# EAGLE design ctecka_stolni (EAGLE 6.5.0)
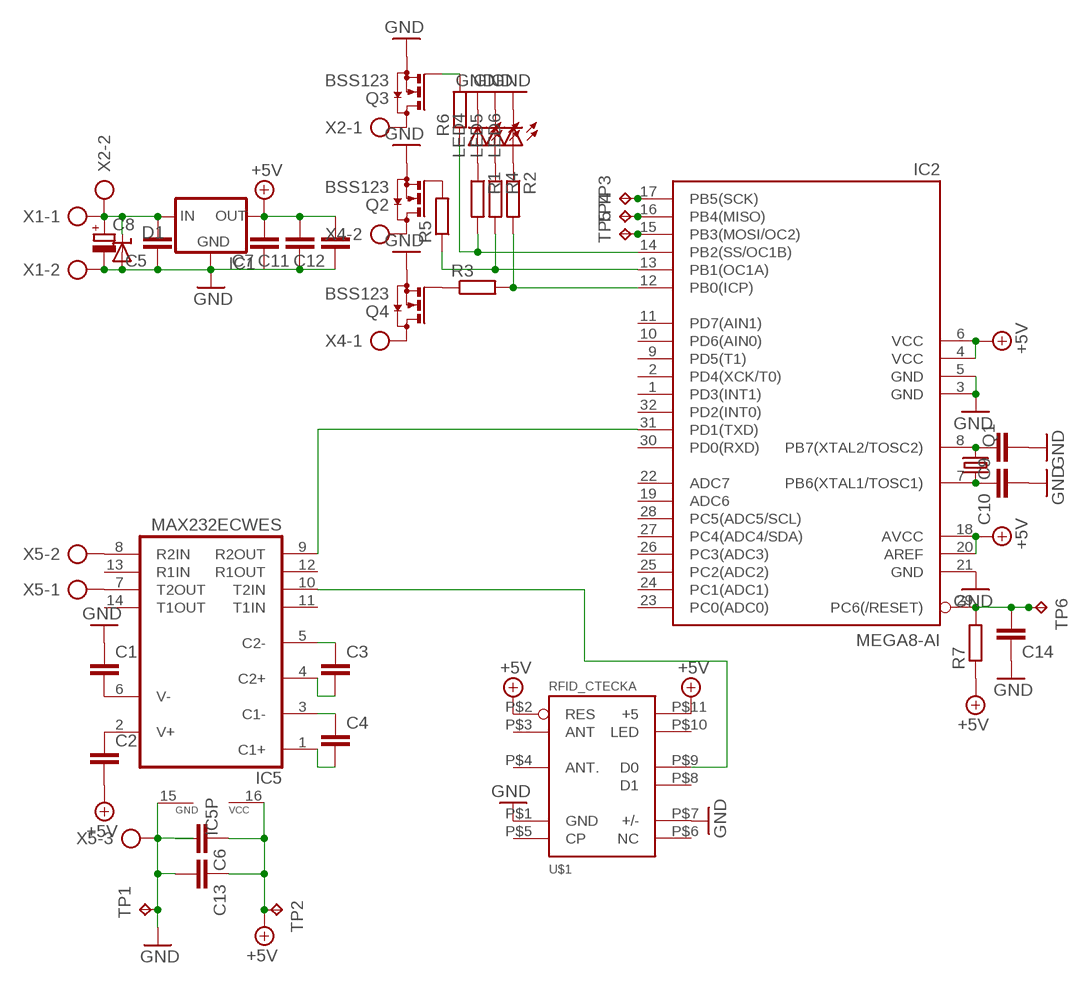
[diagram p0: schematic, sheet 1]

## Parts
C1  C-EUC0603  [C0603]
C2  C-EUC0603  [C0603]
C3  C-EUC0603  [C0603]
C4  C-EUC0603  [C0603]
C5  C-EUC0603  [C0603]
C6  C-EUC0603  [C0603]
C7  C-EUC0603  [C0603]
C8  CPOL-EUSMCD  [SMC_D]
C9  C-EUC0603  [C0603]
C10  C-EUC0603  [C0603]
C11  C-EUC0603  [C0603]
C12  C-EUC0603  [C0603]
C13  C-EUC0603  [C0603]
C14  C-EUC0603  [C0603]
D1  SUPPRESSOR-SMBG  [SMBG]
IC1  78LXXF  [SOT89R]
IC2  MEGA8-AI  [TQFP32-08]
IC5  MAX232ECWES  [SO16]
LED4  LEDCHIP-LED0805  [CHIP-LED0805]
LED5  LEDCHIP-LED0805  [CHIP-LED0805]
LED6  LEDCHIP-LED0805  [CHIP-LED0805]
Q1  CRYSTALCTS406  [CTS406]
Q2  BSS123  [SOT23]
Q3  BSS123  [SOT23]
Q4  BSS123  [SOT23]
R1  R-EU_R0603  [R0603]
R2  R-EU_R0603  [R0603]
R3  R-EU_R0603  [R0603]
R4  R-EU_R0603  [R0603]
R5  R-EU_R0603  [R0603]
R6  R-EU_R0603  [R0603]
R7  R-EU_R0603  [R0603]
TP1  TPB1,27  [B1,27]
TP2  TPB1,27  [B1,27]
TP3  TPB1,27  [B1,27]
TP4  TPB1,27  [B1,27]
TP5  TPB1,27  [B1,27]
TP6  TPB1,27  [B1,27]
U$1  RFID_CTECKA  [H]
X1  AK500/2  [AK500/2]
X2  AK500/2  [AK500/2]
X4  AK500/2  [AK500/2]
X5  AK500/3  [AK500/3]

## Nets
+5V: C2.2 C6.1 C7.2 C11.2 C12.2 C13.1 IC1.2(OUT) IC2.4(VCC) IC2.6(VCC) IC2.18(AVCC) IC2.20(AREF) IC5.16(VCC) R7.1 TP2.TP U$1.P$2(RES) U$1.P$11(+5)
GND: C1.1 C5.1 C6.2 C7.1 C8.- C9.2 C10.2 C11.1 C12.1 C13.2 C14.1 D1.A IC1.3(GND) IC2.3(GND) IC2.5(GND) IC2.21(GND) IC5.15(GND) LED4.C LED5.C LED6.C Q2.2(S) Q3.2(S) Q4.2(S) TP1.TP U$1.P$1(GND) U$1.P$7(+/-) X1.2 X5.3
N$1: IC2.17(PB5(SCK)) TP3.TP
N$2: IC2.15(PB3(MOSI/OC2)) TP5.TP
N$3: Q3.3(D) X2.1
N$4: IC2.31(PD1(TXD)) IC5.9(R2OUT)
N$5: C3.1 IC5.5(C2-)
N$6: C4.1 IC5.3(C1-)
N$7: C1.2 IC5.6(V-)
N$8: C2.1 IC5.2(V+)
N$9: IC5.7(T2OUT) X5.1
N$10: IC5.8(R2IN) X5.2
N$11: C4.2 IC5.1(C1+)
N$12: C3.2 IC5.4(C2+)
N$13: IC2.16(PB4(MISO)) TP4.TP
N$14: C14.2 IC2.29(PC6(/RESET)) R7.2 TP6.TP
N$15: C9.1 IC2.8(PB7(XTAL2/TOSC2)) Q1.3
N$16: C10.1 IC2.7(PB6(XTAL1/TOSC1)) Q1.1
N$17: Q2.1(G) R5.2
N$18: Q2.3(D) X4.2
N$19: Q4.1(G) R3.1
N$20: Q4.3(D) X4.1
N$21: LED4.A R1.1
N$22: LED5.A R4.1
N$23: LED6.A R2.1
N$24: Q3.1(G) R6.2
N$26: IC5.10(T2IN) U$1.P$9(D0)
N$29: IC2.12(PB0(ICP)) R2.2 R3.2
N$30: IC2.13(PB1(OC1A)) R4.2 R5.1
N$31: IC2.14(PB2(SS/OC1B)) R1.2 R6.1
N$34: C5.2 C8.+ D1.C IC1.1(IN) X1.1 X2.2
Unconnected: IC2.1(PD3(INT1)) IC2.2(PD4(XCK/T0)) IC2.9(PD5(T1)) IC2.10(PD6(AIN0)) IC2.11(PD7(AIN1)) IC2.19(ADC6) IC2.22(ADC7) IC2.23(PC0(ADC0)) IC2.24(PC1(ADC1)) IC2.25(PC2(ADC2)) IC2.26(PC3(ADC3)) IC2.27(PC4(ADC4/SDA)) IC2.28(PC5(ADC5/SCL)) IC2.30(PD0(RXD)) IC2.32(PD2(INT0)) IC5.11(T1IN) IC5.12(R1OUT) IC5.13(R1IN) IC5.14(T1OUT) U$1.P$3(ANT) U$1.P$4(ANT.) U$1.P$5(CP) U$1.P$6(NC) U$1.P$8(D1) U$1.P$10(LED)

## Library data of the parts
C1-C7 C9-C14 = rcl:C-EU: CAPACITOR, European symbol
C8 = rcl:CPOL-EU: POLARIZED CAPACITOR, European symbol
D1 = diode:SUPPRESSOR-: Suppressor diode
IC1 = v-reg:78LXXF
IC2 = atmel:MEGA8: MICROCONTROLLER 8 Kbytes FLASH, 1 kbytes SRAM, 512 bytes EEPROM, USART, 6-channel 10 bit ADC, 2-channel 8 bit ADC Pin compatible with Atmega48, ATMega88, ATMega168 Source: avr.lbr
IC5 = maxim:MAX232ECWE: RS232 TRANSEIVER
LED4-LED6 = led:LED: LED OSRAM: - CHIPLED LG R971, LG N971, LY N971, LG Q971, LY Q971, LO R971, LY R971 LH N974, LH R974 LS Q976, LO Q976, LY Q976 LO Q996 - Hyper CHIPLED LW Q18S LB Q993, LB Q99A, LB R99A - SideLED LS A670, LO A670, LY A670, LG A670, LP A670 LB A673, LV A673, LT A673, LW A673 LH A674 LY A675 LS A676, LA A676, LO A676, LY A676, LW A676 LS A679, LY A679, LG A679 - Hyper Micro SIDELED® LS Y876, LA Y876, LO Y876, LY Y876 LT Y87S - SmartLED LW L88C, LW L88S LB L89C, LB L89S, LG L890 LS L89K, LO L89K, LY L89K LS L896, LA L896, LO L896, LY L896 - TOPLED LS T670, LO T670, LY T670, LG T670, LP T670 LSG T670, LSP T670, LSY T670, LOP T670, LYG T670 LG T671, LOG T671, LSG T671 LB T673, LV T673, LT T673, LW T673 LH T674 LS T676, LA T676, LO T676, LY T676, LB T676, LH T676, LSB T676, LW T676 LB T67C, LV T67C, LT T67C, LS T67K, LO T67K, LY T67K, LW E67C LS E67B, LA E67B, LO E67B, LY E67B, LB E67C, LV E67C, LT E67C LW T67C LS T679, LY T679, LG T679 LS T770, LO T770, LY T770, LG T770, LP T770 LB T773, LV T773, LT T773, LW T773 LH T774 LS E675, LA E675, LY E675, LS T675 LS T776, LA T776, LO T776, LY T776, LB T776 LHGB T686 LT T68C, LB T68C - Hyper Mini TOPLED® LB M676 - Mini TOPLED Santana® LG M470 LS M47K, LO M47K, LY M47K Source: http://www.osram.convergy.de LUXEON: - LUMILED® LXK2-PW12-R00, LXK2-PW12-S00, LXK2-PW14-U00, LXK2-PW14-V00 LXK2-PM12-R00, LXK2-PM12-S00, LXK2-PM14-U00 LXK2-PE12-Q00, LXK2-PE12-R00, LXK2-PE12-S00, LXK2-PE14-T00, LXK2-PE14-U00 LXK2-PB12-K00, LXK2-PB12-L00, LXK2-PB12-M00, LXK2-PB14-N00, LXK2-PB14-P00, LXK2-PB14-Q00 LXK2-PR12-L00, LXK2-PR12-M00, LXK2-PR14-Q00, LXK2-PR14-R00 LXK2-PD12-Q00, LXK2-PD12-R00, LXK2-PD12-S00 LXK2-PH12-R00, LXK2-PH12-S00 LXK2-PL12-P00, LXK2-PL12-Q00, LXK2-PL12-R00 Source: www.luxeon.com KINGBRIGHT: KA-3528ASYC Source: www.kingbright.com
Q1 = crystal:CRYSTAL: CRYSTAL; OC_FARNELL: unknown; OC_NEWARK: unknown
Q2-Q4 = transistor-small-signal:BSS123: N-CHANNEL MOS FET
R1-R7 = rcl:R-EU_: RESISTOR, European symbol
TP1-TP6 = testpad:TP: Test pad
U$1 = moje:RFID_CTECKA
X1 X2 X4 = con-ptr500:AK500/2: CONNECTOR
X5 = con-ptr500:AK500/3: CONNECTOR

## Board
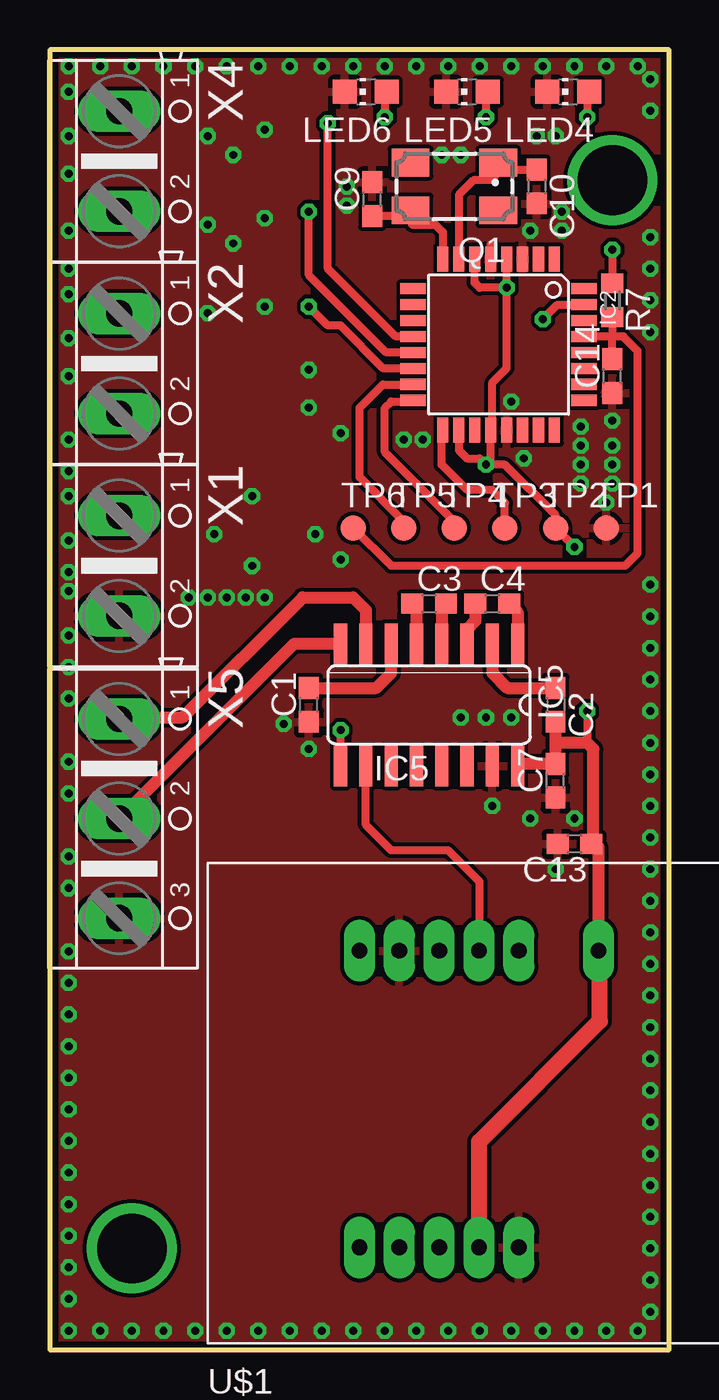
[diagram p1: board, top side]
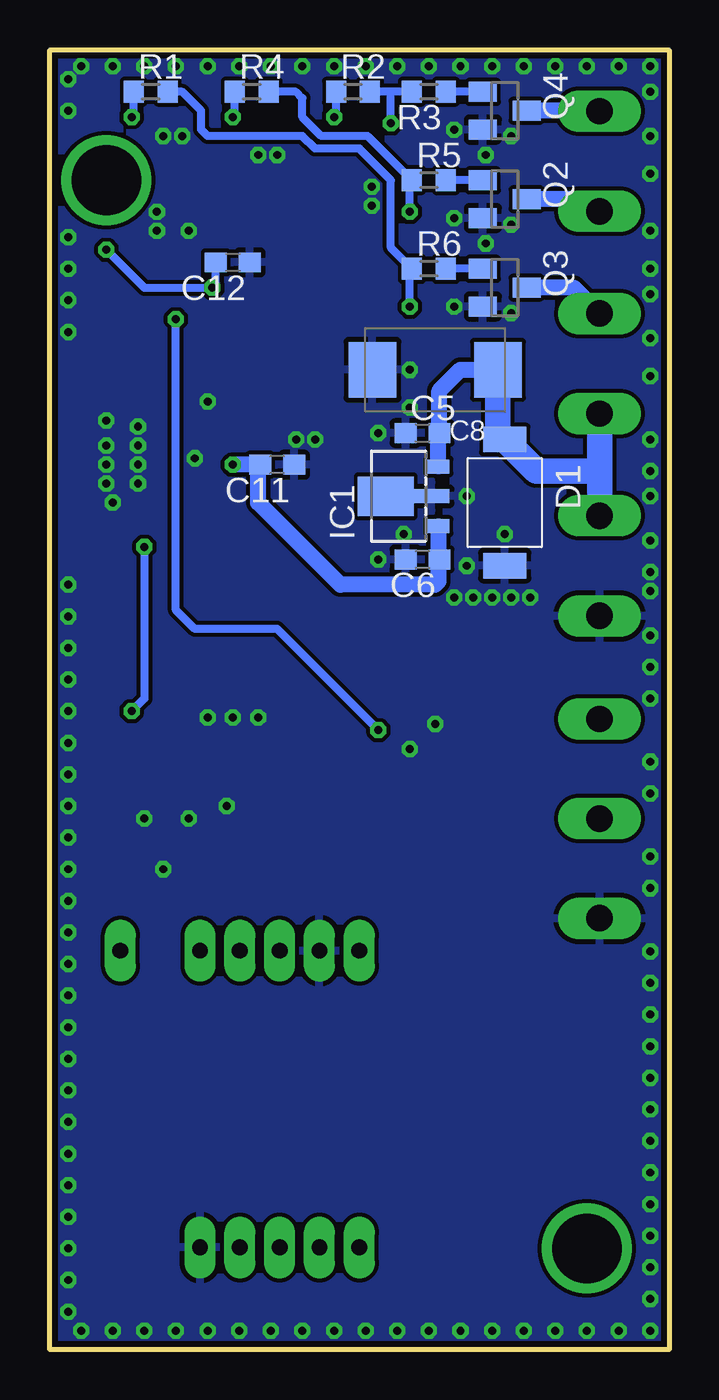
[diagram p2: board, bottom side, seen from below]

Size 31.09 x 65.3 mm. Coordinates in mm from the lower left corner, seen from the top.
Outline: 0,0 31.09,0 31.09,65.3 0,65.3 0,0
Copper layers (1*16): Top 0.035mm / dielectric 1.5mm / Bottom 0.035mm
Design rules "default *": minimum track width 10mil, minimum drill 0.4mm, track to track 8mil, track to pad 8mil, pad to pad 8mil, via to via 8mil, smd to smd 8mil, copper to edge 0.3mm, drill to drill 8mil, minimum pad ring 15mil, minimum via ring 8mil, stop-mask expansion 4mil, vias tented up to drill 0.6mm, thermal gap 10mil

### Footprints (pad centres in the part's own frame; a part is rotated, then mirrored left to right if it is on the bottom)
C0603 = smd 1.1 x 1: 1 -0.85,0; 2 0.85,0
SMC_D = smd 2.4 x 2.8: + -3.15,0; - 3.15,0
SMBG = smd 1.27 x 2.16: A 3.17,0; C -3.17,0
SOT89R = smd 0.7 x 1.1: 1 1.5,-1.75; 2 -1.5,-1.75 | smd 0.7 x 1.8: 3 0,-1.4 | smd 2 x 2.8: 4 0,0.9
TQFP32-08 = smd 1.27 x 0.559: 1 -4.293,2.8; 2 -4.293,2; 3 -4.293,1.2; 4 -4.293,0.4; 5 -4.293,-0.4; 6 -4.293,-1.2; 7 -4.293,-2; 8 -4.293,-2.8; 17 4.293,-2.8; 18 4.293,-2; 19 4.293,-1.2; 20 4.293,-0.4; 21 4.293,0.4; 22 4.293,1.2; 23 4.293,2; 24 4.293,2.8 | smd 0.559 x 1.27: 9 -2.8,-4.293; 10 -2,-4.293; 11 -1.2,-4.293; 12 -0.4,-4.293; 13 0.4,-4.293; 14 1.2,-4.293; 15 2,-4.293; 16 2.8,-4.293; 25 2.8,4.293; 26 2,4.293; 27 1.2,4.293; 28 0.4,4.293; 29 -0.4,4.293; 30 -1.2,4.293; 31 -2,4.293; 32 -2.8,4.293
SO16 = smd 0.66 x 2.032: 1 -4.445,-3.073; 2 -3.175,-3.073; 3 -1.905,-3.073; 4 -0.635,-3.073; 5 0.635,-3.073; 6 1.905,-3.073; 7 3.175,-3.073; 8 4.445,-3.073; 9 4.445,3.073; 10 3.175,3.073; 11 1.905,3.073; 12 0.635,3.073; 13 -0.635,3.073; 14 -1.905,3.073; 15 -3.175,3.073; 16 -4.445,3.073
CHIP-LED0805 = smd 1.2 x 1.2: A 0,-1.05; C 0,1.05
CTS406 = smd 1.9 x 1.4: 1 -2.2,-1.2; 2 2.2,-1.2; 3 2.2,1.2; 4 -2.2,1.2
SOT23 = smd 1 x 1.4: 1 -0.95,-1.1; 2 0.95,-1.1; 3 0,1.1
R0603 = smd 1 x 1.1: 1 -0.85,0; 2 0.85,0
B1,27 = smd 1.27 x 1.27: TP 0,0
H = drill 0.8 long: P$1 10.54,-11.7; P$2 8.54,-11.7; P$3 6.54,-11.7; P$4 4.54,-11.7; P$5 2.54,-11.7; P$6 2.54,3.21; P$7 4.54,3.21; P$8 6.54,3.21; P$9 8.54,3.21; P$10 10.54,3.21; P$11 14.54,3.21
AK500/2 = drill 1.321 long: 1 -2.515,0; 2 2.515,0
AK500/3 = drill 1.321 long: 1 -5.004,0; 2 0,0; 3 5.004,0

### Placement (x,y rotation side)
C1  13.01,32.39 90 top
C2  25.39,32.39 270 top
C3  19.05,37.47 0 top
C4  22.22,37.47 0 top
C5  12.38,46.04 0 bottom
C6  12.38,39.7 180 bottom
C7  25.39,28.58 90 top
C8  11.74,49.22 180 bottom
C9  16.19,57.79 90 top
C10  24.44,58.43 270 top
C11  19.68,44.46 180 bottom
C12  21.9,54.62 180 bottom
C13  26.35,25.41 180 top
C14  28.25,48.9 90 top
D1  8.25,42.55 270 bottom
IC1  13.33,42.87 90 bottom
IC2  22.54,50.49 270 top
IC5  19.05,32.39 180 top
LED4  26.03,63.19 90 top
LED5  20.95,63.19 90 top
LED6  15.87,63.19 90 top
Q1  20.31,58.43 180 top
Q2  8.25,57.79 270 bottom
Q3  8.25,53.35 270 bottom
Q4  8.25,62.24 270 bottom
R1  26.03,63.19 0 bottom
R2  15.87,63.19 0 bottom
R3  12.06,63.19 180 bottom
R4  20.95,63.19 0 bottom
R5  12.06,58.74 0 bottom
R6  12.06,54.3 0 bottom
R7  28.25,52.71 270 top
TP1  27.94,41.28 0 top
TP2  25.39,41.28 0 top
TP3  22.85,41.28 0 top
TP4  20.31,41.28 0 top
TP5  17.77,41.28 0 top
TP6  15.23,41.28 0 top
U$1  13.01,16.84 0 top
X1  3.49,39.38 270 top
X2  3.49,49.54 270 top
X4  3.49,59.7 270 top
X5  3.49,26.68 270 top

### Tracks (layer width: path | path; a pad name or v marks a point on that pad's centre or on a via)
+5V  (via drill 0.4)
  Top 0.406: v22.94,53.35 22.94,49.3 22.22,48.59 22.22,46.28 IC2.20 22.14,44.69 v21.9,44.46 | v22.94,53.35 IC2.4 | IC2.6 21.34,53.6 21.59,53.35 v22.94,53.35 | 27.62,19.98 U$1.P$11 | IC2.18 20.54,45.19 20.95,44.78 21.59,44.78 v21.9,44.46 | v21.9,44.46 22.85,44.46 25.39,41.92 TP2.TP v26.35,40.33 | v28.25,55.25 R7.1 | v26.98,32.07 26.98,30.49
  Top 0.61: IC5.16 23.6,29.43 C7.2 25.39,30.49 | 25.39,30.49 C2.2 | U$1.P$11 27.55,25.24 C13.1 27.3,25.51 27.3,30.17 26.98,30.49 25.39,30.49
  Top 0.813: U$1.P$2 21.55,10.45 27.62,16.52 27.62,19.98
  Bottom 0.406: C12.2 22.75,53.53 v22.94,53.35 26.35,53.35 v28.25,55.25 | IC1.2 11.58,39.75 C6.1 | v26.35,40.33 26.35,32.71 v26.98,32.07
  Bottom 0.813: IC1.2 11.58,38.59 11.74,38.42 16.5,38.42 20.63,42.55 20.63,44.35 C11.2 v21.9,44.46
GND  (via drill 0.4)
  Top 0.406: IC2.5 22.14,55.49 22.22,55.57
  other vias: 6.98,37.79 8.88,37.79 9.84,37.79 10.79,37.79 7.93,37.79 23.17,31.76 21.9,31.76 20.63,31.76 18.73,45.73 17.77,45.73 14.6,39.7 14.92,58.43 14.92,57.48 25.71,56.2 25.71,57.16 19.68,60.02 20.63,60.02 24.44,60.97 25.39,60.97 10.79,61.29 9.2,60.02 7.93,60.97 10.79,56.84 9.2,55.57 7.93,56.52 10.79,52.39 7.93,52.08 16.82,0.96 7.3,0.96 5.71,0.96 4.12,0.96 2.54,0.96 0.95,0.96 15.23,0.96 13.65,0.96 12.06,0.96 10.47,0.96 8.88,0.96 30.16,5.09 24.76,0.96 23.17,0.96 21.59,0.96 20,0.96 18.41,0.96 30.16,3.5 30.16,1.91 29.52,0.96 27.94,0.96 26.35,0.96 18.41,64.46 27.94,64.46 29.52,64.46 0.95,54.3 0.95,53.03 0.95,56.2 20,64.46 21.59,64.46 23.17,64.46 24.76,64.46 26.35,64.46 0.95,64.46 10.47,64.46 12.06,64.46 13.65,64.46 15.23,64.46 16.82,64.46 2.54,64.46 4.12,64.46 5.71,64.46 7.3,64.46 8.88,64.46 0.95,63.19 28.25,44.46 28.25,43.5 26.66,44.46 26.66,43.5 26.66,45.41 30.16,55.89 30.16,54.3 30.16,52.71 30.16,51.12 28.25,45.41 0.95,39.06 0.95,50.81 30.16,63.82 30.16,62.24 0.95,59.06 0.95,60.97 0.95,40.65 0.95,42.87 0.95,44.14 0.95,45.73 0.95,48.9 30.16,22.55 30.16,13.03 30.16,11.44 30.16,9.85 30.16,8.26 30.16,6.67 30.16,20.96 30.16,19.38 30.16,17.79 30.16,16.2 30.16,14.61 26.66,46.36 30.16,30.49 30.16,28.9 30.16,27.31 30.16,25.73 30.16,24.14 30.16,38.42 30.16,36.84 30.16,35.25 30.16,33.66 30.16,32.07 0.95,18.42 0.95,8.9 0.95,7.31 0.95,5.72 0.95,4.13 0.95,2.55 0.95,16.84 0.95,15.25 0.95,13.66 0.95,12.07 0.95,10.48 0.95,35.88 13.01,30.17 0.95,24.77 0.95,23.19 11.74,31.44 0.95,20.01 0.95,34.3 0.95,32.71 0.95,38.11 0.95,29.53 0.95,27.95 22.22,27.31 24.12,26.68 26.35,26.68 25.39,24.14 27.94,42.55 28.25,46.68 23.81,44.77 23.17,47.63 24.12,56.2 8.25,40.96 10.15,39.38 13.33,40.96 10.15,42.87 14.6,46.04 13.01,47.31 13.01,49.22
  pour Bottom: -0.96,65.41 35.24,65.73 35.87,0.01 -0.32,-0.31
  pour Top: -1.28,65.41 35.55,65.41 36.19,-0.31 -0.64,-0.31
N$1
  Top 0.406: TP3.TP 22.85,42.55 22.22,43.19 20.95,43.19 19.68,44.46 19.68,46.14 IC2.17
N$2
  Top 0.406: TP5.TP 17.77,41.6 15.55,43.82 15.55,47.31 16.73,48.49 IC2.15
N$3
  Bottom 0.813: X2.1 4.78,53.35 Q3.3
N$4  (via drill 0.4)
  Top 0.406: v24.76,51.76 25.49,52.49 IC2.31 | IC5.9 v14.6,31.12
  Bottom 0.406: v24.76,51.76 24.76,37.16 23.81,36.2 19.68,36.2 v14.6,31.12
N$5
  Top 0.61: IC5.5 18.41,37.26 arc90 C3.1
N$6
  Top 0.61: IC5.3 20.95,36.2 21.37,36.62 C4.1
N$7
  Top 0.61: IC5.6 17.14,33.98 16.4,33.24 C1.2
N$8
  Top 0.61: IC5.2 22.22,33.98 22.96,33.24 C2.1
N$9
  Top 0.61: X5.1 3.56,31.76 6.66,31.76 12.7,37.79 15.24,37.79 15.87,37.16 IC5.7
N$10
  Top 0.61: X5.2 12.28,35.47 IC5.8
N$11
  Top 0.61: IC5.1 23.49,37.05 C4.2
N$12
  Top 0.61: IC5.4 19.68,37.26 arc-90 C3.2
N$13
  Top 0.406: TP4.TP 20.31,41.6 16.82,45.09 16.82,47.31 17.14,47.63 18.19,47.63 IC2.16
N$14
  Top 0.406: TP6.TP 17.14,39.38 28.89,39.38 29.52,40.01 29.52,50.17 28.81,50.89 28.25,50.89 | 28.25,50.89 IC2.29 | R7.2 28.25,50.89 | C14.2 28.25,50.89
N$15
  Top 0.406: IC2.8 19.74,56.15 19.36,56.52 18.19,56.52 Q1.3 17.77,56.94 C9.1
N$16
  Top 0.406: IC2.7 20.54,58.02 21.27,58.74 22.27,58.74 Q1.1 22.55,59.28 C10.1
N$17
  Bottom 0.406: Q2.1 R5.2
N$18
  Bottom 0.813: X4.2 4.1,57.79 Q2.3
N$19
  Bottom 0.406: Q4.1 R3.1
N$20
  Bottom 0.813: X4.1 3.51,62.24 Q4.3
N$21  (via drill 0.4)
  Top 0.406: LED4.A 26.98,63.09 v26.98,61.92
  Bottom 0.406: v26.98,61.92 26.88,62.02 R1.1
N$22  (via drill 0.4)
  Top 0.406: LED5.A 21.9,63.09 v21.9,61.92
  Bottom 0.406: v21.9,61.92 21.8,62.02 R4.1
N$23  (via drill 0.4)
  Top 0.406: LED6.A 16.82,63.09 v16.82,61.92
  Bottom 0.406: v16.82,61.92 16.72,62.02 R2.1
N$24
  Bottom 0.406: Q3.1 R6.2
N$25  (via drill 3.5)
  other vias: 4.12,5.09
N$26
  Top 0.406: U$1.P$9 21.59,20.08 21.59,23.5 20,25.09 17.14,25.09 15.87,26.36 IC5.10
N$29  (via drill 0.4)
  Top 0.406: IC2.12 17.38,50.89 13.97,54.3 v13.97,61.6
  Bottom 0.406: R3.2 13.97,63.19 | 13.97,63.19 R2.2 | v13.97,61.6 13.97,63.19
N$30  (via drill 0.4)
  Top 0.406: IC2.13 16.91,50.09 13.01,53.98 v13.01,57.16
  Bottom 0.406: R4.2 18.73,63.19 18.41,62.87 18.41,61.92 17.46,60.97 15.13,60.97 R5.1 13.01,58.64 v13.01,57.16
N$31  (via drill 0.4)
  Top 0.406: IC2.14 16.75,49.29 14.6,51.44 13.97,51.44 v13.01,52.39
  Bottom 0.406: R1.2 24.44,63.19 23.49,62.24 23.49,61.29 23.17,60.97 18.41,60.97 17.77,60.33 15.55,60.33 13.97,58.74 13.97,55.35 R6.1 13.01,54.2 v13.01,52.39
N$34
  Bottom 0.813: C8.+ 10.47,49.22 11.53,48.17 C5.2 11.58,45.99 IC1.1
  Bottom 1.27: X1.1 3.49,44.14 | 3.49,44.14 X2.2 | 3.49,44.14 6.67,44.14 D1.C 8.59,46.06 C8.+
N$128  (via drill 3.5)
  other vias: 28.25,58.74

### Text on the board
tDocu: OUT1 | OUT2 | OUT3 | +12V | MOSI | MISO | RST | SCK | VCC | GND | +12V | GND | <-TX | ->RX | GND